# Altium schematic sheet radio.SchDoc
size A4; DocumentNumber: 4; SheetNumber: 4; SheetTotal: 7
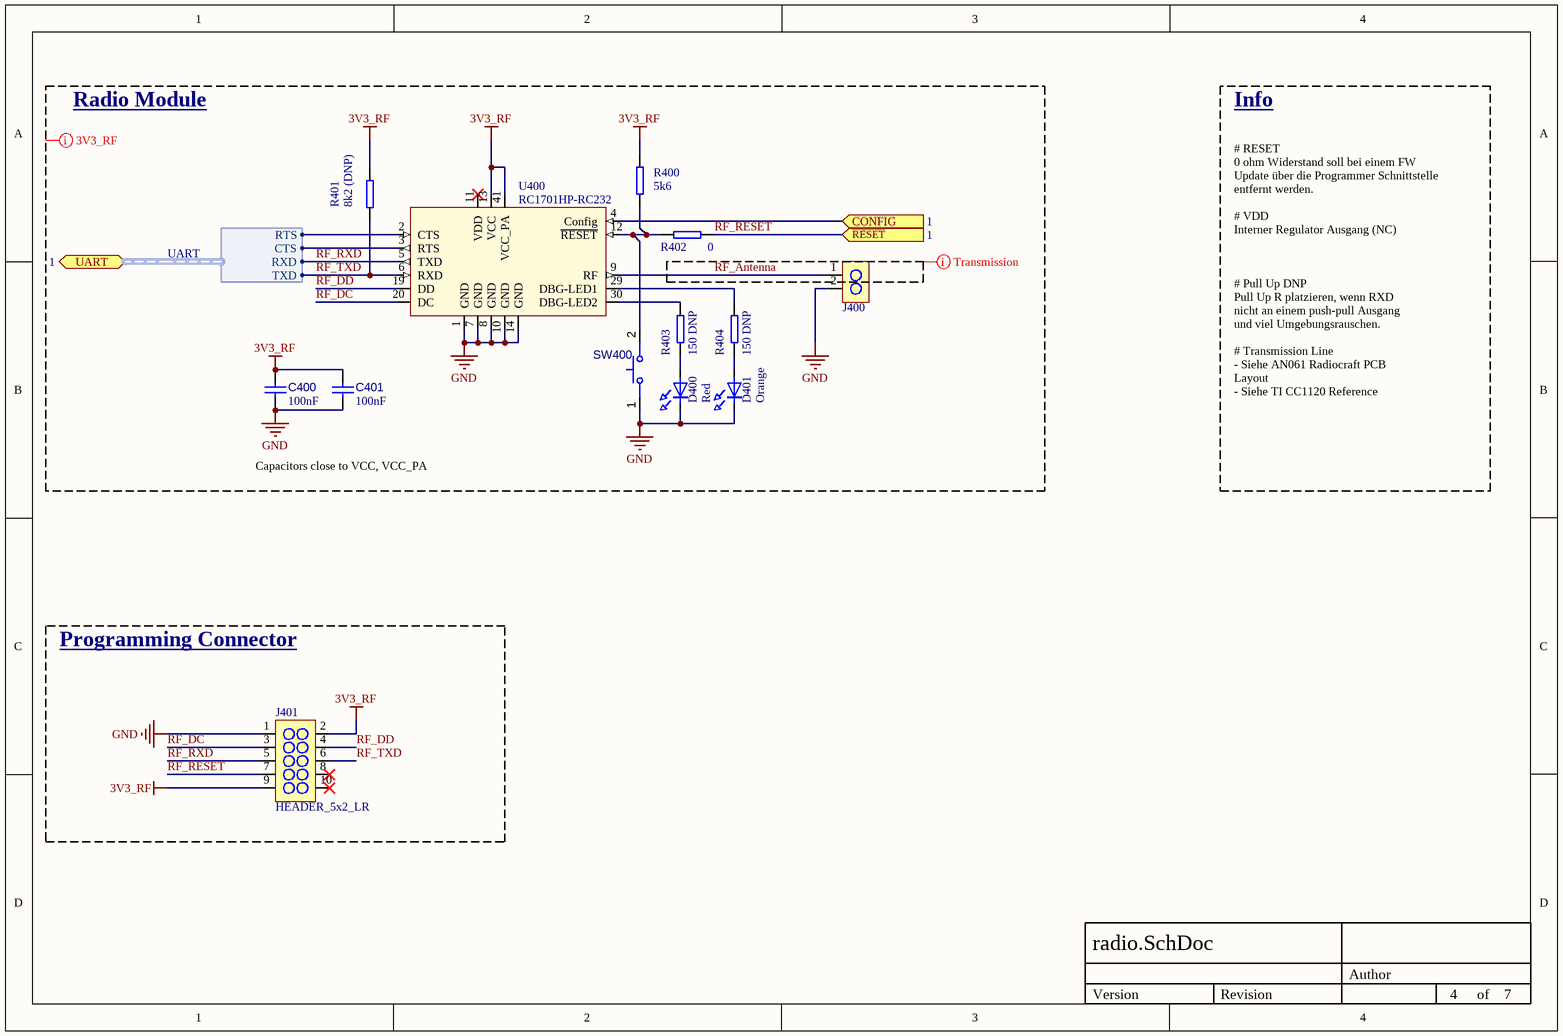
[diagram p0: radio.SchDoc]

## Parts
C400  value 100nF  [0603]
C401  value 100nF  [0603]
D400  Red  [0603-Diode]
D401  Orange  [0603-Diode]
J400  RF_LPRS_x2  [SMARACONNECTOR]  (value not drawn)
J401  HEADER_5x2_LR  [HEADER_SMD_1.27]
R400  5k6  [0603]
R401  8k2 (DNP)  [0603]
R402  0  [0603]
R403  150 DNP  [0603]
R404  150 DNP  [0603]
SW400  B3U-1000P-B  [OMRON-B3U-1000P-2-B_V]  (value not drawn)
U400  RC1701HP-RC232  [RF_RC1701HP]

## Blocks framed on the sheet
Programming Connector: J401

## Ports
CONFIG (in, see 1), UART (bidir, harness UART, see 1), ~{RESET} (in, see 1)

## Harnesses
UART: CTS, RTS, TXD, RXD

## Nets
3V3_RF: C400.2 C401.2 J401.2 J401.9 R400.2 R401.2 U400.13(VCC) U400.41(VCC_PA)
GND: C400.1 C401.1 D400.K D401.K J400.2 J401.1 SW400.1 U400.1(GND) U400.7(GND) U400.8(GND) U400.10(GND) U400.14(GND)
~{RF_RESET}: J401.7 R402.1 ; port ~{RESET}
CONFIG: U400.4(Config) ; port CONFIG
RF_Antenna: J400.1 U400.9(RF)
RF_DC: J401.3 U400.20(DC)
RF_DD: J401.4 U400.19(DD)
RF_RXD: J401.5 U400.5(TXD) ; port UART.RXD
RF_TXD: J401.6 R401.1 U400.6(RXD) ; port UART.TXD
NetD400_A: D400.A R403.2
NetD401_A: D401.A R404.2
NetR400_1: R400.1 R402.2 SW400.2 U400.12(~{RESET})
NetR403_1: R403.1 U400.30(DBG-LED2)
NetR404_1: R404.1 U400.29(DBG-LED1)
NetU400_2: U400.2(CTS) ; port UART.RTS
NetU400_3: U400.3(RTS) ; port UART.CTS

Not connected (* = marked no-connect by the designer): J401 8* 10*; U400 11(VDD)*

## Layout directives
net class TXM: RF_Antenna
net class 3V3_RF: 3V3_RF, GND, RF_Antenna, RF_DC, RF_DD, RF_RXD, RF_TXD, ~{RF_RESET}

## Notes on the sheet
- Radio Module
- Info
- # RESET
  0 ohm Widerstand soll bei einem FW Update über die Programmer Schnittstelle entfernt werden.
  # VDD
  Interner Regulator Ausgang (NC)
- # Pull Up DNP
  Pull Up R platzieren, wenn RXD nicht an einem push-pull Ausgang und viel Umgebungsrauschen.
- # Transmission Line
  - Siehe AN061 Radiocraft PCB Layout
  - Siehe TI CC1120 Reference Design
- Capacitors close to VCC, VCC_PA
- Author
- Version
- Revision
- of

## Library data of the parts
C400 C401 = C: Manufacturer: TDK; Manufacturer Part Number: C1005X6S0J105K050BC; Manufacturer: Murata; Manufacturer Part Number: GRM155R60J105KE19D; Manufacturer: Kyocera AVX; Manufacturer Part Number: 04026D105KAT2A; Voltage Rating: 6.3V; Tolerance: 10%; Mounting Technology: SM; Pins: 2; Case/Package: 0402; RoHS Compliant: True; Max Operating Temperature: 85°C; Component Type: Capacitors
D400 D401 = LED_1
R400-R404 = R?: Normaler Widerstand
SW400 = CMP-011-00011-1: Ultra-small Surface-mounting Tactile Switches with High Contact Reliability, SPST-NO, -25 to 70 degC, 2-Pin SMD, RoHS, Tape and Reel; Voltage Rating: 12V; RoHS Compliant: Details; Pins: 2
J401 = HEADER_5x2_LR: Supplier 1: Rs; Supplier Part Number 1: 2053212